# Altium schematic sheet Processor.SchDoc: PNEV5180B
size A3; Date: 15.9.2015; DrawnBy: GVR; Address1: A3; Revision: 2.0; SheetNumber: 2; SheetTotal: 3
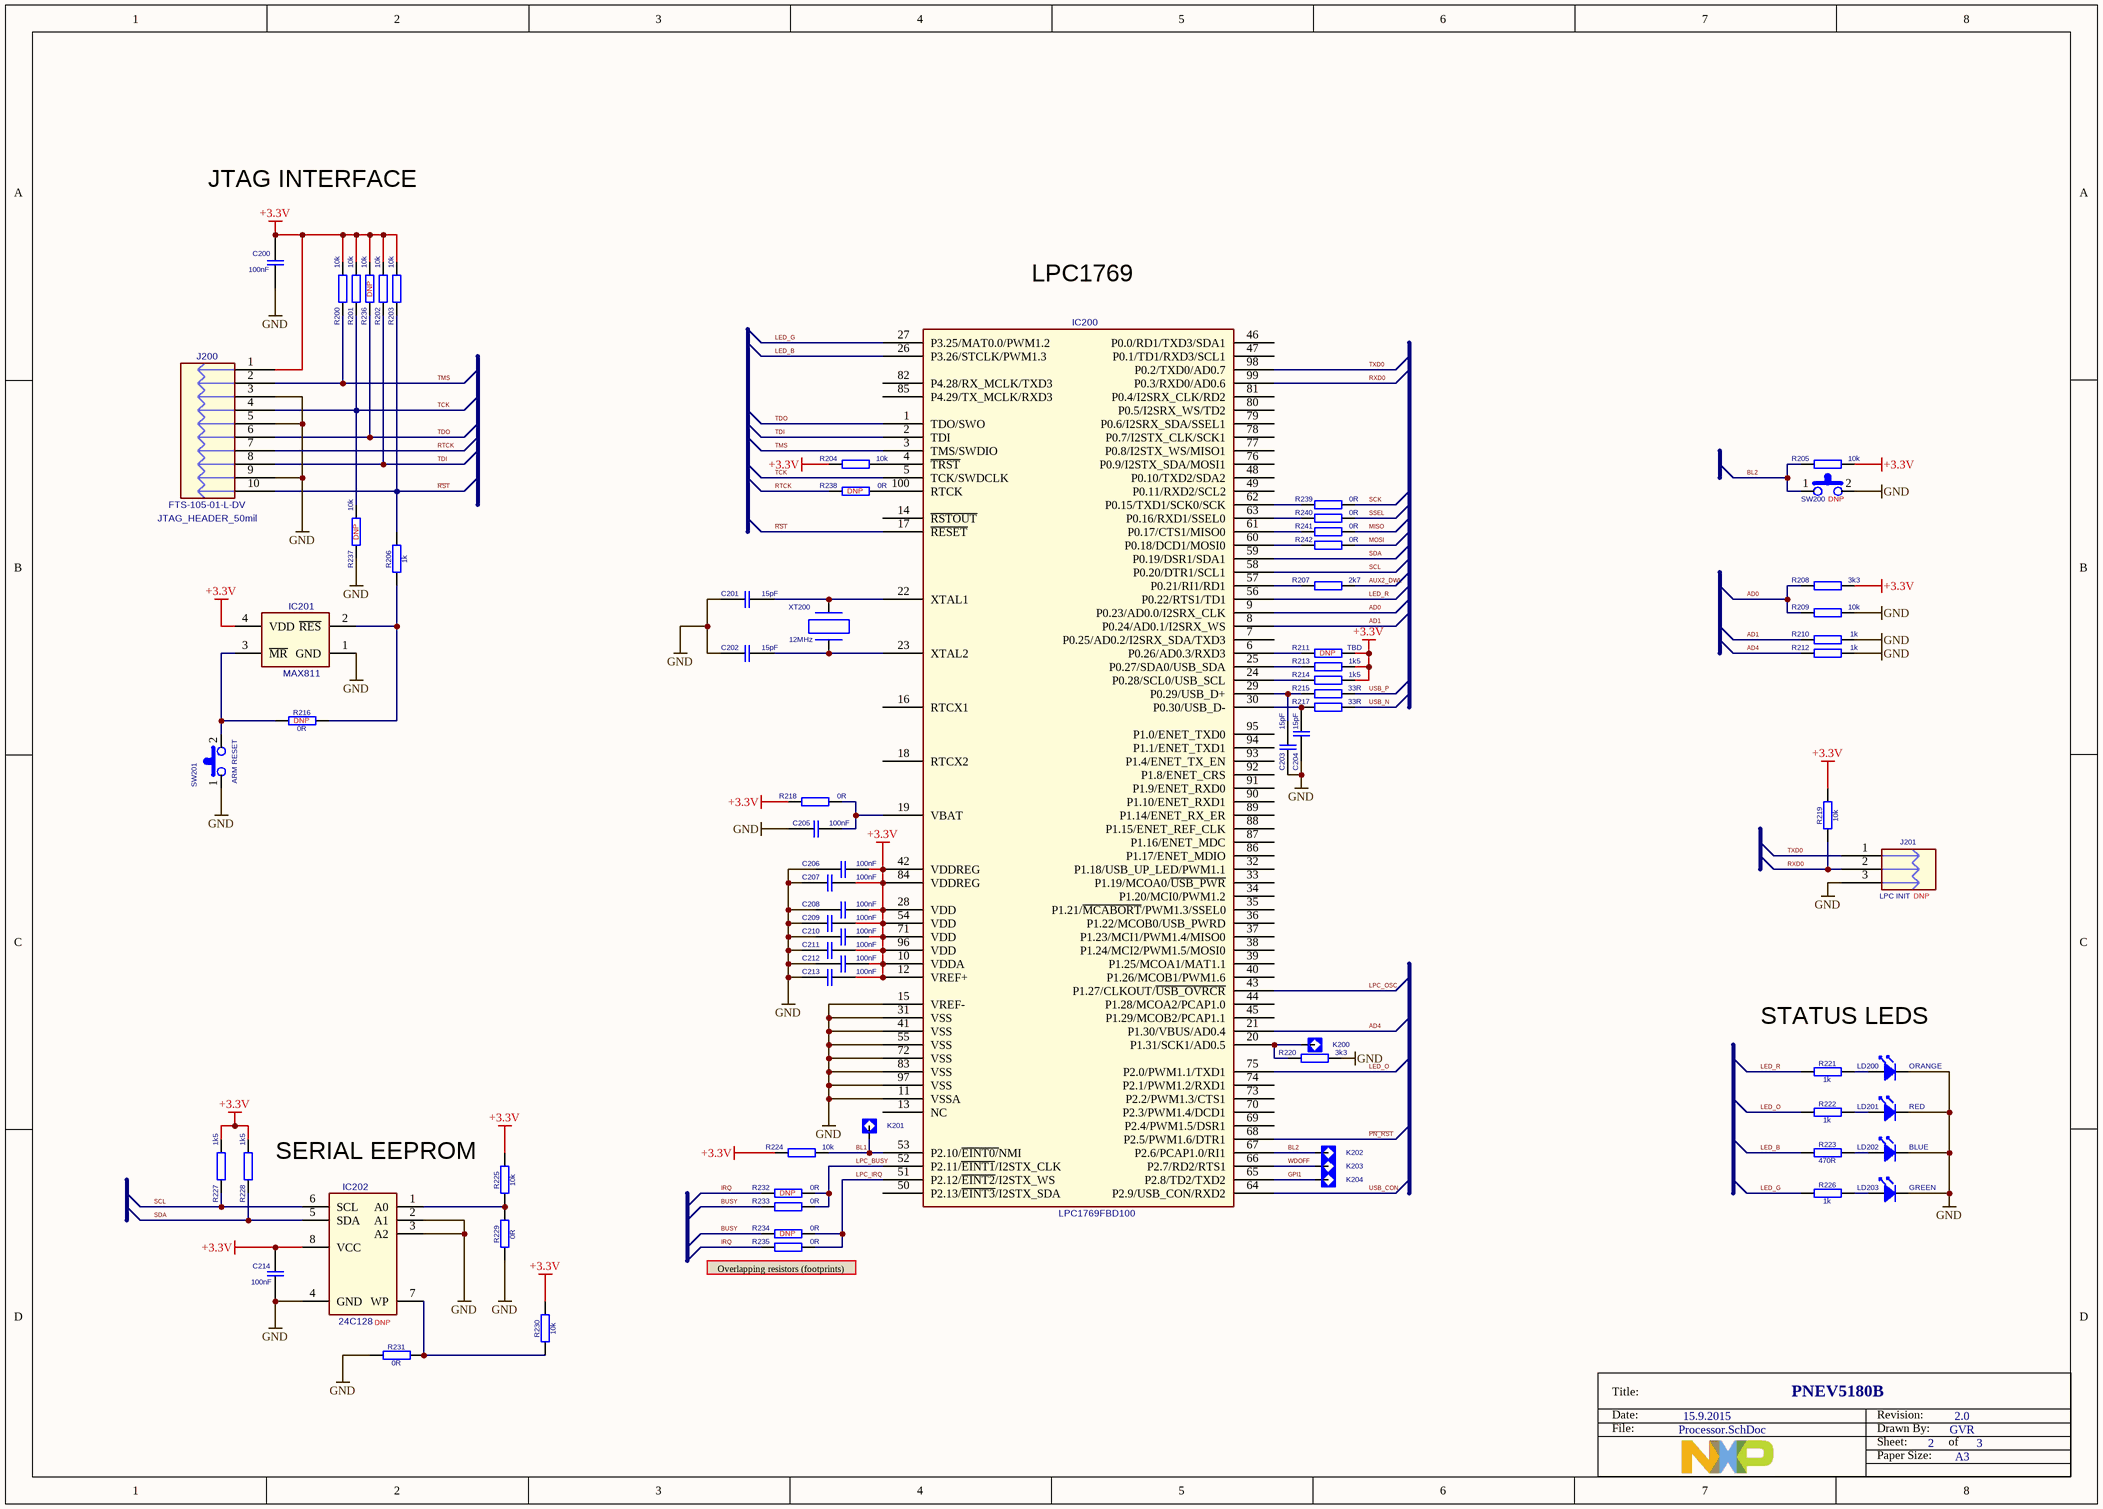
[diagram p0: Processor.SchDoc]

## Parts
?  (no value)
C200  100nF  [Y0603]
C201  15pF  [Y0603]
C202  15pF  [Y0603]
C203  15pF  [Y0603]
C204  15pF  [Y0603]
C205  100nF  [Y0402]
C206  100nF  [Y0402]
C207  100nF  [Y0402]
C208  100nF  [Y0402]
C209  100nF  [Y0402]
C210  100nF  [Y0402]
C211  100nF  [Y0402]
C212  100nF  [Y0402]
C213  100nF  [Y0402]
C214  100nF  [Y0603]
IC200  LPC1769FBD100  [TSQFP50P1600X1600X160-100N]
IC201  MAX811  [SOT143B]
IC202  value 24C128  [SOIC8]  (hidden comment: 24C128 DNP)
J200  FTS-105-01-L-DV  [CON_FTS-105-01-L-DV]
J201  value LPC INIT  [CON3M-LINE]  (hidden comment: LPC INIT DNP)
K200  TP1  [TESTP_ROUND_1.0mm]  (value not drawn)
K201  TP1  [TESTP_ROUND_1.0mm]  (value not drawn)
K202  TP1  [TESTP_ROUND_1.0mm]  (value not drawn)
K203  TP1  [TESTP_ROUND_1.0mm]  (value not drawn)
K204  TP1  [TESTP_ROUND_1.0mm]  (value not drawn)
LD200  ORANGE  [LED_0603]
LD201  RED  [LED_0603]
LD202  BLUE  [LED_0603]
LD203  GREEN  [LED_0603]
R200  10k  [Y0603]
R201  10k  [Y0603]
R202  10k  [Y0603]
R203  10k  [Y0603]
R204  10k  [Y0603]
R205  10k  [Y0603]
R206  1k  [Y0603]
R207  2k7  [Y0603]
R208  3k3  [Y0603]
R209  10k  [Y0603]
R210  1k  [Y0603]
R211  value TBD  [Y0603]  (hidden comment: TBD DNP)
R212  1k  [Y0603]
R213  1k5  [Y0603]
R214  1k5  [Y0603]
R215  33R  [Y0603]
R216  value 0R  [Y0603]  (hidden comment: 0R DNP)
R217  33R  [Y0603]
R218  0R  [Y0603]
R219  10k  [Y0603]
R220  3k3  [Y0603]
R221  1k  [Y0603]
R222  1k  [Y0603]
R223  470R  [Y0603]
R224  10k  [Y0603]
R225  10k  [Y0603]
R226  1k  [Y0603]
R227  1k5  [Y0603]
R228  1k5  [Y0603]
R229  0R  [Y0603]
R230  10k  [Y0603]
R231  0R  [Y0603]
R232  value 0R  [Y0805]  (hidden comment: 0R DNP)
R233  0R  [Y0805]
R234  value 0R  [Y0805]  (hidden comment: 0R DNP)
R235  0R  [Y0805]
R236  value 10k  [Y0603]  (hidden comment: 10k DNP)
R237  value 10k  [Y0603]  (hidden comment: 10k DNP)
R238  value 0R  [Y0603]  (hidden comment: 0R DNP)
R239  0R  [Y0402]
R240  0R  [Y0402]
R241  0R  [Y0402]
R242  0R  [Y0402]
SW200  DTSM-32S-B DNP  [SW_DTSM-32S-B]  (value not drawn)
SW201  DTSM-32S-B  [SW_DTSM-32S-B]  (value not drawn)
XT200  12MHz  [QUARTZ_NX5032GA]

## Nets
+3.3V: C200.1 C206.2 C207.2 C208.2 C209.2 C210.2 C211.2 C212.2 C213.2 C214.2 IC200.10(VDDA) IC200.12(VREF+) IC200.28(VDD) IC200.42(VDDREG) IC200.54(VDD) IC200.71(VDD) IC200.84(VDDREG) IC200.96(VDD) IC201.4(VDD) IC202.8(VCC) J200.1 R200.2 R201.2 R202.2 R203.2 R204.2 R205.1 R208.1 R211.1 R213.1 R214.1 R218.2 R219.2 R224.2 R225.1 R227.1 R228.1 R230.1 R236.2
GND: C200.2 C201.2 C202.2 C203.1 C204.1 C205.1 C206.1 C207.1 C208.1 C209.1 C210.1 C211.1 C212.1 C213.1 C214.1 IC200.11(VSSA) IC200.15(VREF-) IC200.31(VSS) IC200.41(VSS) IC200.55(VSS) IC200.72(VSS) IC200.83(VSS) IC200.97(VSS) IC201.1(GND) IC202.2(A1) IC202.3(A2) IC202.4(GND) J200.3 J200.5 J200.9 J201.3(P3) LD200.1 LD201.1 LD202.1 LD203.1 R209.1 R210.1 R212.1 R220.1 R229.2 R231.2 R237.1 SW200.2 SW201.1
AD0: IC200.9(P0.23/AD0.0/I2SRX_CLK) R208.2 R209.2
AD1: IC200.8(P0.24/AD0.1/I2SRX_WS) R210.2
AD4: IC200.21(P1.30/VBUS/AD0.4) R212.2
AUX2_DWL: R207.1
BL1: IC200.53(P2.10/~{EINT0/}NMI) K201.1 R224.1
BL2: IC200.67(P2.6/PCAP1.0/RI1) K202.1 R205.2 SW200.1
BUSY: R233.1 R234.1
GPI1: IC200.65(P2.8/TD2/TXD2) K204.1
IRQ: R232.1 R235.1
LED_B: IC200.26(P3.26/STCLK/PWM1.3) R223.1
LED_G: IC200.27(P3.25/MAT0.0/PWM1.2) R226.1
LED_O: IC200.75(P2.0/PWM1.1/TXD1) R222.1
LED_R: IC200.56(P0.22/RTS1/TD1) R221.1
LPC_BUSY: IC200.52(P2.11/~{EINT1}/I2STX_CLK) R232.2 R233.2
LPC_IRQ: IC200.51(P2.12/~{EINT2}/I2STX_WS) R234.2 R235.2
LPC_OSC: IC200.43(P1.27/CLKOUT/~{USB_OVRCR})
MISO: R241.1
MOSI: R242.1
~{PN_RST}: IC200.68(P2.5/PWM1.6/DTR1)
~{RST}: IC200.17(~{RESET}) J200.10 R203.1 R206.2
RTCK: J200.7 R238.2
RXD0: IC200.99(P0.3/RXD0/AD0.6) J201.2(P2) R219.1
SCK: R239.1
SCL: IC200.58(P0.20/DTR1/SCL1) IC202.6(SCL) R227.2
SDA: IC200.59(P0.19/DSR1/SDA1) IC202.5(SDA) R228.2
SSEL: R240.1
TCK: IC200.5(TCK/SWDCLK) J200.4 R201.1 R237.2
TDI: IC200.2(TDI) J200.8 R202.1
TDO: IC200.1(TDO/SWO) J200.6 R236.1
TMS: IC200.3(TMS/SWDIO) J200.2 R200.1
TXD0: IC200.98(P0.2/TXD0/AD0.7) J201.1(P1)
USB_CON: IC200.64(P2.9/USB_CON/RXD2)
USB_N: R217.1
USB_P: R215.1
WDOFF: IC200.66(P2.7/RD2/RTS1) K203.1
NetC201_1: C201.1 IC200.22(XTAL1) XT200.2
NetC202_1: C202.1 IC200.23(XTAL2) XT200.1
NetC203_2: C203.2 IC200.29(P0.29/USB_D+) R215.2
NetC204_2: C204.2 IC200.30(P0.30/USB_D-) R217.2
NetC205_2: C205.2 IC200.19(VBAT) R218.1
NetIC200_4: IC200.4(~{TRST}) R204.1
NetIC200_6: IC200.6(P0.26/AD0.3/RXD3) R211.2
NetIC200_20: IC200.20(P1.31/SCK1/AD0.5) K200.1 R220.2
NetIC200_24: IC200.24(P0.28/SCL0/USB_SCL) R214.2
NetIC200_25: IC200.25(P0.27/SDA0/USB_SDA) R213.2
NetIC200_57: IC200.57(P0.21/RI1/RD1) R207.2
NetIC200_60: IC200.60(P0.18/DCD1/MOSI0) R242.2
NetIC200_61: IC200.61(P0.17/CTS1/MISO0) R241.2
NetIC200_62: IC200.62(P0.15/TXD1/SCK0/SCK) R239.2
NetIC200_63: IC200.63(P0.16/RXD1/SSEL0) R240.2
NetIC200_100: IC200.100(RTCK) R238.1
NetIC201_2: IC201.2(~{RES}) R206.1 R216.2
NetIC201_3: IC201.3(~{MR}) R216.1 SW201.2
NetIC202_1: IC202.1(A0) R225.2 R229.1
NetIC202_7: IC202.7(WP) R230.2 R231.1
NetLD200_2: LD200.2 R221.2
NetLD201_2: LD201.2 R222.2
NetLD202_2: LD202.2 R223.2
NetLD203_2: LD203.2 R226.2

Not connected (* = marked no-connect by the designer): IC200 7(P0.25/AD0.2/I2SRX_SDA/TXD3) 13(NC) 14(~{RSTOUT}) 16(RTCX1) 18(RTCX2) 32(P1.18/USB_UP_LED/PWM1.1) 33(P1.19/MCOA0/~{USB_PWR}) 34(P1.20/MCI0/PWM1.2) 35(P1.21/~{MCABORT}/PWM1.3/SSEL0) 36(P1.22/MCOB0/USB_PWRD) 37(P1.23/MCI1/PWM1.4/MISO0) 38(P1.24/MCI2/PWM1.5/MOSI0) 39(P1.25/MCOA1/MAT1.1) 40(P1.26/MCOB1/PWM1.6) 44(P1.28/MCOA2/PCAP1.0) 45(P1.29/MCOB2/PCAP1.1) 46(P0.0/RD1/TXD3/SDA1) 47(P0.1/TD1/RXD3/SCL1) 48(P0.10/TXD2/SDA2) 49(P0.11/RXD2/SCL2) 50(P2.13/~{EINT3}/I2STX_SDA) 69(P2.4/PWM1.5/DSR1) 70(P2.3/PWM1.4/DCD1) 73(P2.2/PWM1.3/CTS1) 74(P2.1/PWM1.2/RXD1) 76(P0.9/I2STX_SDA/MOSI1) 77(P0.8/I2STX_WS/MISO1) 78(P0.7/I2STX_CLK/SCK1) 79(P0.6/I2SRX_SDA/SSEL1) 80(P0.5/I2SRX_WS/TD2) 81(P0.4/I2SRX_CLK/RD2) 82(P4.28/RX_MCLK/TXD3) 85(P4.29/TX_MCLK/RXD3) 86(P1.17/ENET_MDIO) 87(P1.16/ENET_MDC) 88(P1.15/ENET_REF_CLK) 89(P1.14/ENET_RX_ER) 90(P1.10/ENET_RXD1) 91(P1.9/ENET_RXD0) 92(P1.8/ENET_CRS) 93(P1.4/ENET_TX_EN) 94(P1.1/ENET_TXD1) 95(P1.0/ENET_TXD0)

## Notes on the sheet
- JTAG INTERFACE
- LPC1769
- STATUS LEDS
- SERIAL EEPROM
- (near R235) Overlapping resistors (footprints)
- Title:
- Date:
- File:
- Revision:
- Drawn By:
- Sheet:
- Paper Size:
- of
- (in symbol CON_JTAG_PINS) JTAG_HEADER_50mil
- (in symbol SWITCH_SMD) ARM RESET

## Library data of the parts
? = Title Block NXP
C200-C204 C214 = CAPC0603
  C200 C214: Value: 100nF
  C201-C204: Value: 15pF
C205-C213 = CAPC0402: Value: 100nF
IC200 = LPC176XFBD100: LQFP100; DNP: DNP; Value: LPC1769FBD100
IC202 = 24CXX: SERIAL EEPROM; DNP: DNP
J200 = CON_JTAG_PINS: 50mil, 2x5 pin (M), SMD; DNP: DNP; Value: FTS-105-01-L-DV
J201 = CON3M_LINE: DNP: DNP
LD200-LD203 = LEDY0603: DNP: DNP
  LD200: Value: ORANGE
  LD201: Value: RED
  LD202: Value: BLUE
  LD203: Value: GREEN
R200-R231 R236-R238 = RESC0603
  R200-R205 R209 R219 R224 R225 R230: Value: 10k
  R206 R210 R212 R221 R222 R226: Value: 1k
  R207: Value: 2k7; DNP: DNP
  R208 R220: Value: 3k3
  R211 R216 R236-R238: DNP: DNP
  R213 R214 R227 R228: Value: 1k5
  R215 R217: Value: 33R
  R218 R231: Value: 0R
  R223: Value: 470R
  R229: DNP: DNP; Value: 0R
R232-R235 = RESC0805: DNP: DNP
  R233 R235: Value: 0R
R239-R242 = RESC0402: Value: 0R; DNP: DNP
SW200 = SWITCH_SMD: DTSM-32S-B; DNP: DNP; Value: DTSM-32S-B
SW201 = SWITCH_SMD: DNP: DNP; Value: DTSM-32S-B
XT200 = QUARTZ_NX5032: Value: 12MHz